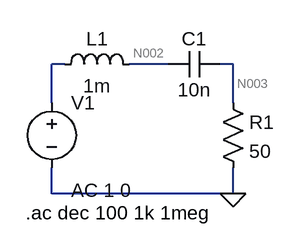
[diagram p0: schematic fig4.asc]
fig4.asc, the LTspice schematic file:
Version 4.1
SHEET 1 880 680
WIRE 48 80 32 80
WIRE 176 80 128 80
WIRE 256 80 240 80
WIRE 32 128 32 80
WIRE 256 128 256 80
WIRE 32 240 32 208
WIRE 256 240 256 208
WIRE 256 240 32 240
FLAG 256 240 0
SYMBOL voltage 32 112 R0
WINDOW 123 24 124 Left 2
WINDOW 39 0 0 Left 0
SYMATTR Value2 AC 1 0
SYMATTR InstName V1
SYMATTR Value ""
SYMBOL ind 32 96 R270
WINDOW 0 32 56 VTop 2
WINDOW 3 5 56 VBottom 2
SYMATTR InstName L1
SYMATTR Value 1m
SYMATTR SpiceLine Rser=0
SYMBOL cap 240 64 R90
WINDOW 0 0 32 VBottom 2
WINDOW 3 32 32 VTop 2
SYMATTR InstName C1
SYMATTR Value 10n
SYMBOL res 240 112 R0
SYMATTR InstName R1
SYMATTR Value 50
TEXT 0 264 Left 2 !.ac dec 100 1k 1meg

The netlist it stands for:
* fig4.asc
V1 N001 0 AC 1 0
L1 N001 N002 1m Rser=0
C1 N003 N002 10n
R1 N003 0 50
.ac dec 100 1k 1meg
.backanno
.end

* Results of the author's LTspice run, read from the files saved beside the schematic
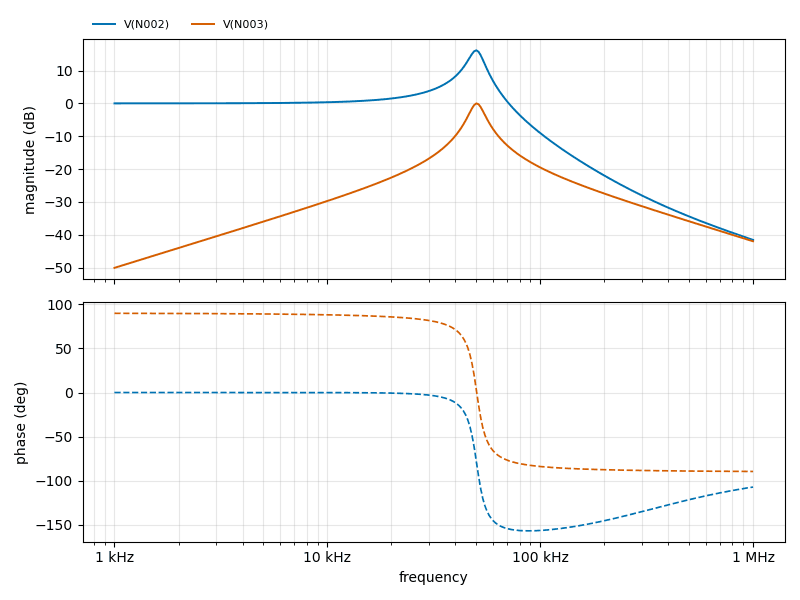
[diagram p1: AC Analysis of fig4.asc, plotted from the saved traces]
* AC Analysis, 1 run:
*   V(N002): 0.00 dB at 1 kHz, -41.54 dB at 1 MHz, peak 16.15 dB at 50.12 kHz, 3 dB below the peak at 45.86 kHz and 53.87 kHz
*   V(N003): -50.05 dB at 1 kHz, -41.96 dB at 1 MHz, peak -0.01 dB at 50.12 kHz, 3 dB below the peak at 46.5 kHz and 54.48 kHz